# EAGLE schematic EC544 (EAGLE 9.6.2)
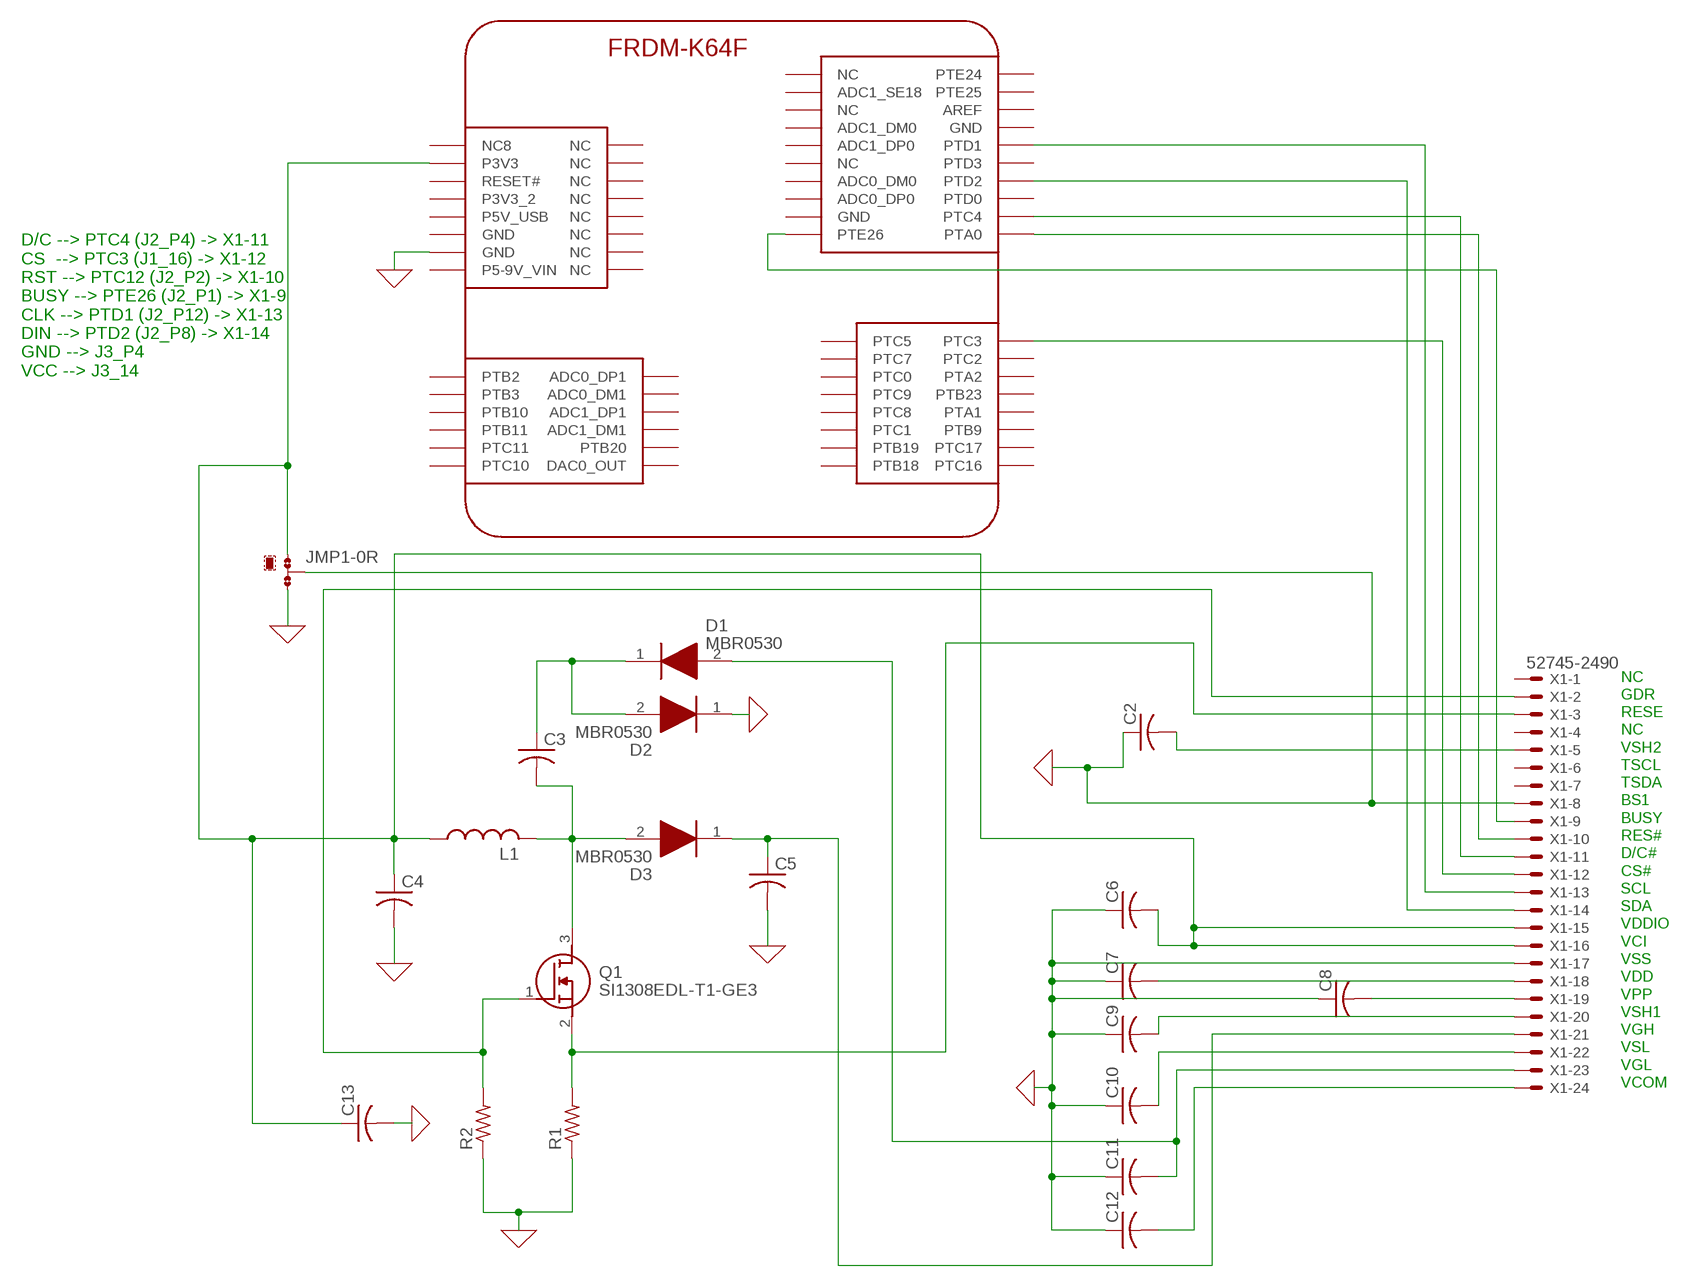
[diagram p0: schematic, sheet 1]

## Parts
C2  C-US025-024X044  [C025-024X044]
C3  C-US025-024X044  [C025-024X044]
C4  C-US025-024X044  [C025-024X044]
C5  C-US025-024X044  [C025-024X044]
C6  C-US025-024X044  [C025-024X044]
C7  C-US025-024X044  [C025-024X044]
C8  C-US025-024X044  [C025-024X044]
C9  C-US025-024X044  [C025-024X044]
C10  C-US025-024X044  [C025-024X044]
C11  C-US025-024X044  [C025-024X044]
C12  C-US025-024X044  [C025-024X044]
C13  C-US025-024X044  [C025-024X044]
D1  MBR0530  [SOD3716X135N]
D2  MBR0530  [SOD3716X135N]
D3  MBR0530  [SOD3716X135N]
FRDM1  FRDM-K64FNORMAL  [FRDM_K64F]
JMP1  0R-JUMPA  [A0R-JMP]
L1  L-USPIS2816  [PIS2816]
Q1  SI1308EDL-T1-GE3  [SOT65P210X110-3N]
R1  R-US_0204/5  [0204/5]
R2  R-US_0204/5  [0204/5]
X1  52745-2490  [52745-2490]

## Nets
0: C2.1 C4.2 C5.2 C6.1 C7.1 C8.1 C9.1 C10.1 C11.1 C12.1 C13.2 D2.1(K) FRDM1.J3.14(GND) JMP1.2 JMP1.3 R1.1 R2.1 X1.8 X1.17 ; supply symbol labelled GND
N$1: C2.2 X1.5
N$2: C4.1 C6.2 C13.1 FRDM1.J3.4(P3V3) JMP1.1 L1.1 X1.15 X1.16
N$3: C3.1 D1.1(K) D2.2(A)
N$4: C7.2 X1.18
N$5: C9.2 X1.20
N$6: C10.2 X1.22
N$7: C11.2 D1.2(A) X1.23
N$8: C12.2 X1.24
N$9: C3.2 D3.2(A) L1.2 Q1.3(D)
N$10: C5.1 D3.1(K) X1.21
N$11: Q1.1(G) R2.2 X1.2
N$12: Q1.2(S) R1.2 X1.3
N$14: FRDM1.J2.1(PTE26) X1.9
N$16: FRDM1.J2.2(PTA0) X1.10
N$17: FRDM1.J2.4(PTC4) X1.11
N$18: FRDM1.J1.16(PTC3) X1.12
N$19: FRDM1.J2.12(PTD1) X1.13
N$20: FRDM1.J2.8(PTD2) X1.14
N$21: C8.2 X1.19
Unconnected: FRDM1.J1.1(PTB18) FRDM1.J1.2(PTC16) FRDM1.J1.3(PTB19) FRDM1.J1.4(PTC17) FRDM1.J1.5(PTC1) FRDM1.J1.6(PTB9) FRDM1.J1.7(PTC8) FRDM1.J1.8(PTA1) FRDM1.J1.9(PTC9) FRDM1.J1.10(PTB23) FRDM1.J1.11(PTC0) FRDM1.J1.12(PTA2) FRDM1.J1.13(PTC7) FRDM1.J1.14(PTC2) FRDM1.J1.15(PTC5) FRDM1.J2.3(GND) FRDM1.J2.5(ADC0_DP0) FRDM1.J2.6(PTD0) FRDM1.J2.7(ADC0_DM0) FRDM1.J2.9(NC) FRDM1.J2.10(PTD3) FRDM1.J2.11(ADC1_DP0) FRDM1.J2.13(ADC1_DM0) FRDM1.J2.14(GND) FRDM1.J2.15(NC) FRDM1.J2.16(AREF) FRDM1.J2.17(ADC1_SE18) FRDM1.J2.18(PTE25) FRDM1.J2.19(NC) FRDM1.J2.20(PTE24) FRDM1.J3.1(NC) FRDM1.J3.2(NC) FRDM1.J3.3(NC) FRDM1.J3.5(NC) FRDM1.J3.6(RESET#) FRDM1.J3.7(NC) FRDM1.J3.8(P3V3_2) FRDM1.J3.9(NC) FRDM1.J3.10(P5V_USB) FRDM1.J3.11(NC) FRDM1.J3.12(GND) FRDM1.J3.13(NC) FRDM1.J3.15(NC8) FRDM1.J3.16(P5-9V_VIN) FRDM1.J4.1(ADC0_DP1) FRDM1.J4.2(PTB2) FRDM1.J4.3(ADC0_DM1) FRDM1.J4.4(PTB3) FRDM1.J4.5(ADC1_DP1) FRDM1.J4.6(PTB10) FRDM1.J4.7(ADC1_DM1) FRDM1.J4.8(PTB11) FRDM1.J4.9(PTB20) FRDM1.J4.10(PTC11) FRDM1.J4.11(DAC0_OUT) FRDM1.J4.12(PTC10) X1.1 X1.4 X1.6 X1.7

## Notes on the sheet
- D/C --> PTC4 (J2_P4) -> X1-11
  CS  --> PTC3 (J1_16) -> X1-12
  RST --> PTC12 (J2_P2) -> X1-10
  BUSY --> PTE26 (J2_P1) -> X1-9
  CLK --> PTD1 (J2_P12) -> X1-13
  DIN --> PTD2 (J2_P8) -> X1-14
  GND --> J3_P4
  VCC --> J3_14
- NC
  GDR
  RESE
  NC
  VSH2
  TSCL
  TSDA
  BS1
  BUSY
  RES#
  D/C#
  CS#
  SCL
  SDA
  VDDIO
  VCI
  VSS
  VDD
  VPP
  VSH1
  VGH
  VSL
  VGL
  VCOM

## Library data of the parts
C2-C13 = rcl:C-US: CAPACITOR, American symbol; SPICEPREFIX: C
D1-D3 = MBR0530:MBR0530: ON SEMICONDUCTOR - MBR0530 - DIODE, SCHOTTKY, 0.5A, 30V, SOD-123 Source: Datasheet <http://www.onsemi.com/pub/Collateral/MBR0530T1-D.PDF>; ARROW_PART_NUMBER: MBR0530; ARROW_PRICE-STOCK: https://www.arrow.com/en/products/mbr0530/on-semiconductor?region=nac; DESCRIPTION: ON SEMICONDUCTOR - MBR0530 - DIODE, SCHOTTKY, 0.5A, 30V, SOD-123; HEIGHT: 1.35mm; MANUFACTURER_NAME: ON Semiconductor; MANUFACTURER_PART_NUMBER: MBR0530; MOUSER_PART_NUMBER: 512-MBR0530; MOUSER_PRICE-STOCK: https://www.mouser.co.uk/ProductDetail/ON-Semiconductor-Fairchild/MBR0530?qs=VOMQJJE%252BBNniwJKcE3T43Q%3D%3D
FRDM1 = Freedom:FRDM-K64F: For creating FRDM-K64F shields
JMP1 = jump-0r-smd:0R-JUMP: SMD 0R 0805 Jumper
L1 = rcl:L-US: INDUCTOR, American symbol; SPICEPREFIX: L
Q1 = Si1308EDL-T1-GE3:SI1308EDL-T1-GE3: MOSFET N-Ch 30V 1.5A TrenchFET SC70 Vishay Si1308EDL-T1-GE3 N-channel MOSFET Transistor, 1.5 A, 30 V, 3-Pin SC-70 Source: Datasheet <https://componentsearchengine.com/Datasheets/1/SI1308EDL-T1-GE3.pdf>; ARROW_PART_NUMBER: SI1308EDL-T1-GE3; ARROW_PRICE-STOCK: https://www.arrow.com/en/products/si1308edl-t1-ge3/vishay?region=nac; DESCRIPTION: MOSFET N-Ch 30V 1.5A TrenchFET SC70 Vishay Si1308EDL-T1-GE3 N-channel MOSFET Transistor, 1.5 A, 30 V, 3-Pin SC-70; HEIGHT: 1.1mm; MANUFACTURER_NAME: Vishay; MANUFACTURER_PART_NUMBER: Si1308EDL-T1-GE3; MOUSER_PART_NUMBER: 78-SI1308EDL-T1-GE3; MOUSER_PRICE-STOCK: https://www.mouser.co.uk/ProductDetail/Vishay-Semiconductors/SI1308EDL-T1-GE3?qs=bX1%252BNvsK%2FBramh9tgpOaEw%3D%3D
R1 R2 = rcl:R-US_: RESISTOR, American symbol; SPICEPREFIX: R
X1 = con-molex:52745-2490: FFC/FPC-to-Board 0.50mm (.020") SMT Top Contact Right Angle, ZIF, Style Receptacle 52745 / 52435 Source: http://www.molex.com/product/ffc/52745.html; MF: MOLEX; OC_FARNELL: unknown; OC_NEWARK: unknown